# Altium project protoboard.PrjPcb
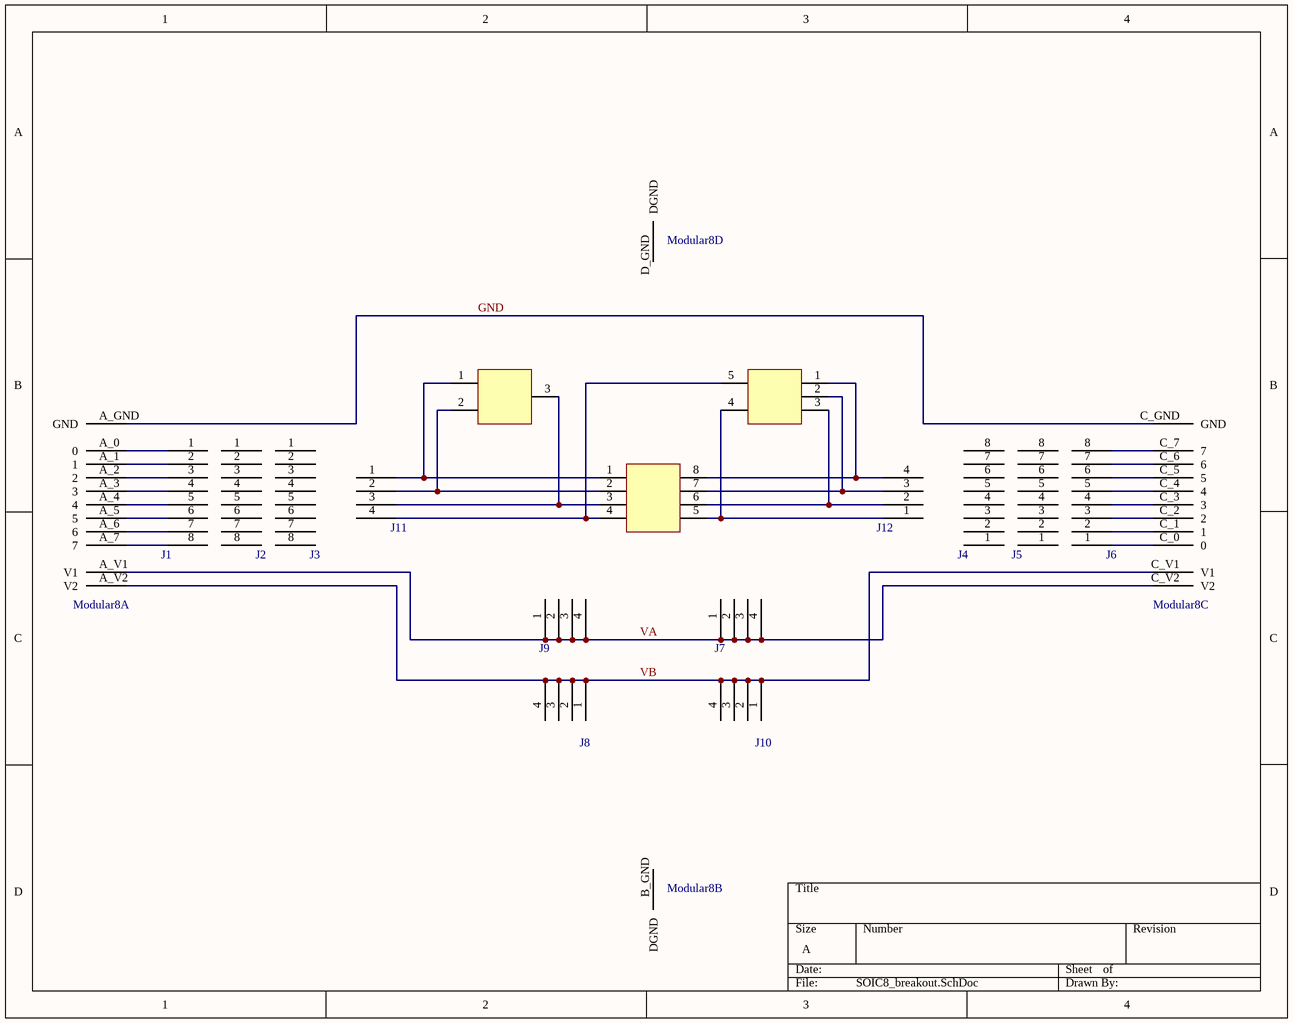
[diagram p0: SOIC8_breakout.SchDoc]
1 sheet, 16 parts. Net scope: global (net labels, ports and power ports of the same name join across sheets).
Board files: SOIC8_breakout_005.PcbDoc, edge_bridge.PcbDoc

## Sheet SOIC8_breakout.SchDoc
size A

### Parts
J1  8x1  [8x1 THRU HOLES 0.1" PITCH]  (value not drawn)
J2  8x1  [8x1 THRU HOLES 0.1" PITCH]  (value not drawn)
J3  8x1  [8x1 THRU HOLES 0.1" PITCH]  (value not drawn)
J4  8x1  [8x1 THRU HOLES 0.1" PITCH]  (value not drawn)
J5  8x1  [8x1 THRU HOLES 0.1" PITCH]  (value not drawn)
J6  8x1  [8x1 THRU HOLES 0.1" PITCH]  (value not drawn)
J7  4x1  [4x1 THRU HOLES 0.1" PITCH]  (value not drawn)
J8  4x1  [4x1 THRU HOLES 0.1" PITCH]  (value not drawn)
J9  4x1  [4x1 THRU HOLES 0.1" PITCH]  (value not drawn)
J10  4x1  [4x1 THRU HOLES 0.1" PITCH]  (value not drawn)
J11  4x1  [4x1 THRU HOLES 0.1" PITCH]  (value not drawn)
J12  4x1  [4x1 THRU HOLES 0.1" PITCH]  (value not drawn)
Modular8  modular8_rev2_A&C  [modular8 edges A & C]  (value not drawn)  (parts A,B,C,D of 4)
S1  Generic 8-pin device  [SOIC8]  (value not drawn)
S2  Generic 3-pin device  [SOT-23-3]  (value not drawn)
S3  Generic 5-pin device  [SOT-23-5]  (value not drawn)

### Nets
GND: Modular8.A_GND(GND) Modular8.C_GND(GND)
VA: J7.1 J7.2 J7.3 J7.4 J9.1 J9.2 J9.3 J9.4 Modular8.A_V1(V1) Modular8.C_V2(V2)
VB: J8.1 J8.2 J8.3 J8.4 J10.1 J10.2 J10.3 J10.4 Modular8.A_V2(V2) Modular8.C_V1(V1)
NetJ1_1: J1.1 Modular8.A_0(0)
NetJ1_2: J1.2 Modular8.A_1(1)
NetJ1_3: J1.3 Modular8.A_2(2)
NetJ1_4: J1.4 Modular8.A_3(3)
NetJ1_5: J1.5 Modular8.A_4(4)
NetJ1_6: J1.6 Modular8.A_5(5)
NetJ1_7: J1.7 Modular8.A_6(6)
NetJ1_8: J1.8 Modular8.A_7(7)
NetJ6_1: J6.1 Modular8.C_0(0)
NetJ6_2: J6.2 Modular8.C_1(1)
NetJ6_3: J6.3 Modular8.C_2(2)
NetJ6_4: J6.4 Modular8.C_3(3)
NetJ6_5: J6.5 Modular8.C_4(4)
NetJ6_6: J6.6 Modular8.C_5(5)
NetJ6_7: J6.7 Modular8.C_6(6)
NetJ6_8: J6.8 Modular8.C_7(7)
NetJ11_1: J11.1 S1.1 S2.1
NetJ11_2: J11.2 S1.2 S2.2
NetJ11_3: J11.3 S1.3 S2.3
NetJ11_4: J11.4 S1.4 S3.5
NetJ12_1: J12.1 S1.5 S3.4
NetJ12_2: J12.2 S1.6 S3.3
NetJ12_3: J12.3 S1.7 S3.2
NetJ12_4: J12.4 S1.8 S3.1

Not connected (* = marked no-connect by the designer): J2 1 2 3 4 5 6 7 8; J3 1 2 3 4 5 6 7 8; J4 1 2 3 4 5 6 7 8; J5 1 2 3 4 5 6 7 8; Modular8 B_GND(DGND) D_GND(DGND)